# Altium schematic sheet 3.3V.SchDoc
size A3; SheetNumber: 3; SheetTotal: 3; SPICEModelCacheDQQPIFSE: <root> / <DocumentId>DQQPIFSE</DocumentId> / <CacheFrame Number="0"> / <Model Name="cout" Kind="CKT"> / <Text>*$ / .SUBCKT Cout 2 4 / R1 2 3 0.0031 / C1 3 4 7.231815776419501E-6 / R3 5 4 5 / R2 2 4 1.3827785868946785E8 / R4 3 26 688888.8888888889 / R6 3 7 688.8888888888889 / C5 7 1 2.1695447329258503E-7 / R7 3 10 68.88888888888889 / C6 10 1 2.1695447329258503E-7 / R8 3 13 6.888888888888889 / C7 13 1 2.1695447329258503E-7 / C2 26 1 2.1695447329258503E-7 / R9 3 28 68888.88888888889 / C3 28 1 2.1695447329258503E-7 / R10 3 29 6888.88888888889 / C4 29 1 2.1695447329258503E-7 / L8 1 5 15p / R24 1 5 0.0093 / L12 5 4 1n / .ENDS</Text> / </Model> / <Model Name="3010_74438333022_2.2u" Kind="CKT"> / <Text>******* / .subckt 3010_74438333022_2.2u 1 2 / Rp 1 2 5803.666667 / Cp 1 2 4.724p / Rs 1 N3 0.15 / L1 N3 2 2.1u / .ends 3010_74438333022_2.2u</Text> / </Model> / </CacheFrame> / </root>
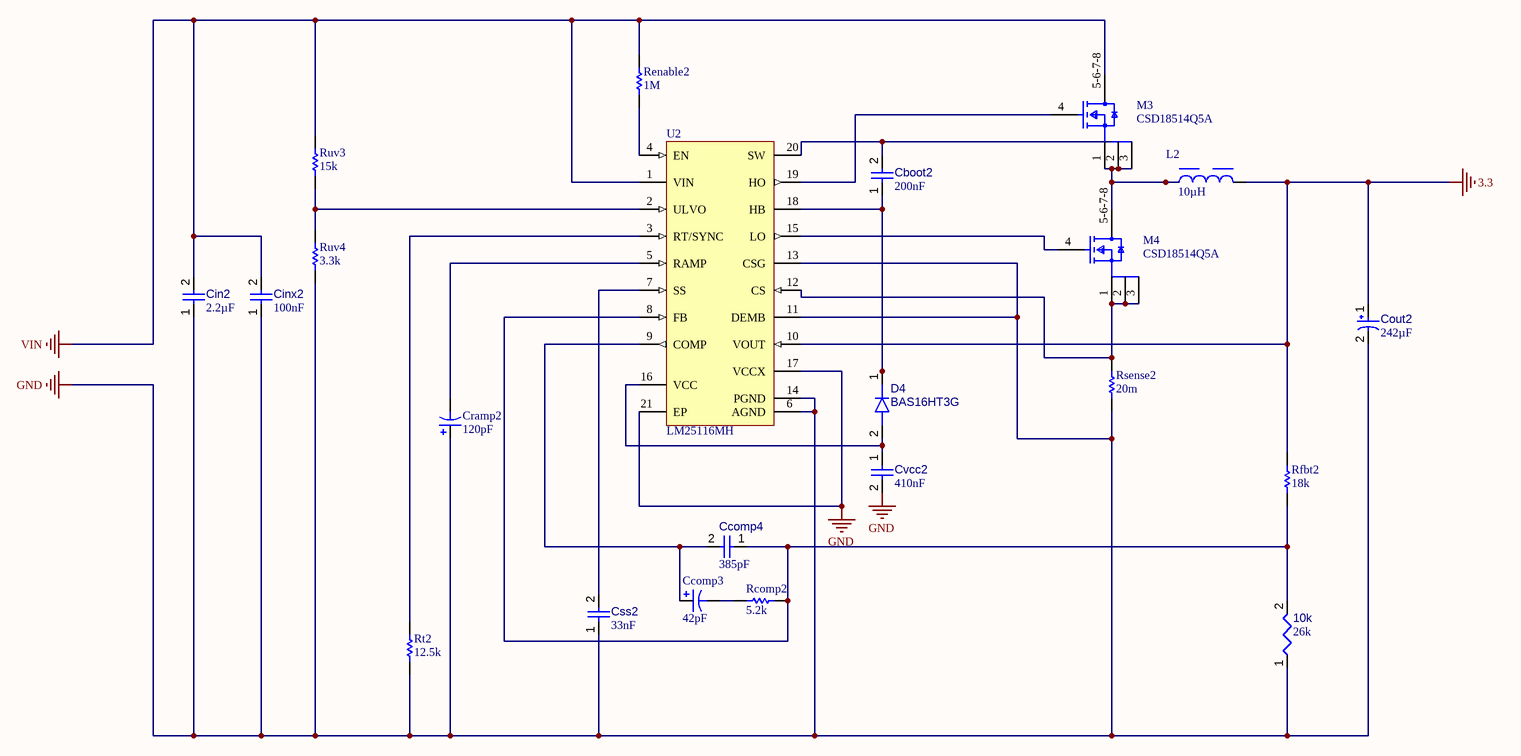
[diagram p0: 3.3V.SchDoc]

## Parts
10k  value 26k  [RESC2013X50X35ML15T15]  (hidden comment: Resistor 10k +/-1% 0805 125 mW)
Cboot2  value 200nF  [CAPC2013X95X50LL10T25]  (hidden comment: Capacitor 100 nF +/-10% 50 V 0805)
Ccomp3  value 42pF  [C0805]  (hidden comment: Cap Pol3)
Ccomp4  value 385pF  [CAPC2013X135X45NL10T25]  (hidden comment: Capacitor 10 uF +/- 10% 16 V 0805)
Cin2  value 2.2µF  [CAPC2013X135X45NL10T25]  (hidden comment: Capacitor 1 uF +/- 10% 50 V 0805)
Cinx2  value 100nF  [CAPC2013X95X50LL10T25]  (hidden comment: Capacitor 100 nF +/-10% 50 V 0805)
Cout2  value 242µF  [CAPPR65-500-1250X1000X1350]  (hidden comment: ECA-1HM221)
Cramp2  value 120pF  [C0805]  (hidden comment: Cap Pol3)
Css2  value 33nF  [CAPC2013X95X50LL10T25]  (hidden comment: Capacitor 100 nF +/-10% 50 V 0805)
Cvcc2  value 410nF  [CAPC2013X145X50ML20T25]  (hidden comment: Capacitor 1 uF +/- 10% 25 V 0805)
D4  BAS16HT3G
L2  Inductance: 10µH  [WE-MAPI_3010]  (hidden comment: 74438333022)
M3  CSD18514Q5A  [FP-DQJ0008A-MFG]
M4  CSD18514Q5A  [FP-DQJ0008A-MFG]
Rcomp2  value 5.2k  [RESC2013X50X35ML15T15]  (hidden comment: Resistor 0R +/- 1% 0805 125 mW)
Renable2  value 1M  [RESC2013X50X35ML15T15]  (hidden comment: Resistor 0R +/- 1% 0805 125 mW)
Rfbt2  value 18k  [RESC2013X50X35ML15T15]  (hidden comment: Resistor 0R +/- 1% 0805 125 mW)
Rsense2  value 20m  [RESC2013X50X35ML15T15]  (hidden comment: Resistor 0R +/- 1% 0805 125 mW)
Rt2  value 12.5k  [RESC2013X50X35ML15T15]  (hidden comment: Resistor 0R +/- 1% 0805 125 mW)
Ruv3  value 15k  [RESC2013X50X35ML15T15]  (hidden comment: Resistor 0R +/- 1% 0805 125 mW)
Ruv4  value 3.3k  [RESC2013X50X35ML15T15]  (hidden comment: Resistor 0R +/- 1% 0805 125 mW)
U2  LM25116MH  [PWP0020A_N]

## Nets
3.3: Cout2.1 L2.2 Rfbt2.2 U2.10(VOUT)
GND: 10k.1 Cin2.1 Cinx2.1 Cout2.2 Cramp2.1 Css2.1 Cvcc2.2 Rsense2.1 Rt2.1 Ruv4.1 U2.6(AGND) U2.11(DEMB) U2.13(CSG) U2.14(PGND) U2.17(VCCX) U2.21(EP)
VIN: Cin2.2 Cinx2.2 M3.5-6-7-8(D) Renable2.2 Ruv3.2 U2.1(VIN)
Net10k_2: 10k.2 Ccomp4.1 Rcomp2.1 Rfbt2.1 U2.8(FB)
NetCboot2_1: Cboot2.1 D4.1(K) U2.18(HB)
NetCboot2_2: Cboot2.2 U2.20(SW)
NetCcomp3_1: Ccomp3.1 Ccomp4.2 U2.9(COMP)
NetCcomp3_2: Ccomp3.2 Rcomp2.2
NetCramp2_2: Cramp2.2 U2.5(RAMP)
NetCss2_2: Css2.2 U2.7(SS)
NetCvcc2_1: Cvcc2.1 D4.2(A) U2.16(VCC)
NetL2_1: L2.1 M3.1(S) M3.2(S) M3.3(S) M4.5-6-7-8(D)
NetM3_4: M3.4(G) U2.19(HO)
NetM4_1: M4.1(S) M4.2(S) M4.3(S) Rsense2.2 U2.12(CS)
NetM4_4: M4.4(G) U2.15(LO)
NetRenable2_1: Renable2.1 U2.4(EN)
NetRt2_2: Rt2.2 U2.3(RT/SYNC)
NetRuv3_1: Ruv3.1 Ruv4.2 U2.2(ULVO)

## Library data of the parts
10k = CMP-009-00018-5: Chip Resistor, 10 KOhm, +/- 1%, 125 mW, -55 to 155 degC, 0805 (2012 Metric); Power: 125mW; Voltage Rating: 150V; Tolerance: 1%; Pins: 2; Min Operating Temperature: -55°C; Case/Package: 0805; Max Operating Temperature: 155°C; RoHS Compliant: True; Mounting Technology: SM
Cboot2 Cinx2 Css2 = CMP-001-00018-6: Chip Capacitor, 100 nF, +/- 10%, 50 V, 0805 (2012 Metric); Capacitor Type: Ceramic; Voltage Rating: 50V; Pins: 2; Max Operating Temperature: 125°C; Min Operating Temperature: -55°C; Mounting Technology: SM; Case/Package: 0805; RoHS Compliant: True; Tolerance: 10%
Ccomp3 Cramp2 = CMP-001-00095-1: Polarized Capacitor (Surface Mount); Signal Integrity: Cap Pol; Component Type: Standard; Case/Package: Chip Capacitor; Source: Miscellaneous Devices.SchLib; Publisher: Altium Limited; Published: 8-Jun-2000; PackageReference: C0805; LatestRevisionDate: 29-May-2009; Pins: 2; LatestRevisionNote: IPC-7351 Footprint Added.; Design Item ID: Cap Pol3
Ccomp4 = CMP-001-00015-6: Chip Capacitor, 10 uF, +/- 10%, 16 V, 0805 (2012 Metric); Voltage Rating: 16V; Capacitor Type: Ceramic; RoHS Compliant: True; Max Operating Temperature: 85°C; Min Operating Temperature: -55°C; Mounting Technology: SM; Tolerance: 10%; Case/Package: 0805; Pins: 2
Cin2 = CMP-001-00007-6: Chip Capacitor, 1 uF, +/- 10%, 50 V, 0805 (2012 Metric); Capacitor Type: Ceramic; Voltage Rating: 50V; Min Operating Temperature: -55°C; RoHS Compliant: True; Mounting Technology: SM; Case/Package: 0805; Max Operating Temperature: 125°C; Tolerance: 10%; Pins: 2
Cout2 = CMP-001-00028-7: Aluminum Electrolytic Capacitor, 220 uF, +/- 20%, 50 V, -40 to 85 degC, 2-Pin THD, RoHS, Bulk; Manufacturer: Panasonic; Ripple Current (AC): 400mA; Voltage Rating: 50V; Case/Package: Radial; Packaging: Bulk; Package Quantity: 200; Min Operating Temperature: -40°C; Datasheet Version: Mar-16; Package Reference: CAPPR65-500-1250X1000X1350; Mounting Technology: TH; Ripple Current: 400mA; Pins: 2; Package Description: 2-Pin Radial Lead, Dia 10 mm, Body Length 12.5 mm; RoHS Compliant: True; Max Operating Temperature: 85°C; Lead Pitch: 5mm; Tolerance: 20%; Manufacturer URL: http://www.panasonic.com/; Diameter: 10mm; Capacitor Type: Electrolytic; Datasheet URL: http://industrial.panasonic.com/cdbs/www-data/pdf/RDF0000/DMF0000COL68.pdf
Cvcc2 = CMP-001-00010-6: Chip Capacitor, 1 uF, +/-10%, 25 V, 0805 (2012 Metric); Capacitor Type: Ceramic; Voltage Rating: 25V; RoHS Compliant: True; Pins: 2; Mounting Technology: SM; Max Operating Temperature: 125°C; Min Operating Temperature: -55°C; Tolerance: 10%; Case/Package: 0805
D4 = CMP-004-00126-1: Rectifier Diode Small Signal Switching 0.2A 6ns Automotive 2-Pin SOD-323 T/R; Forward Voltage: 715mV; Max Operating Temperature: 150°C; Pins: 2; Min Operating Temperature: -55°C; Case/Package: SOD-323-2
L2 = CMP-006-00070-1: WE-MAPI SMT Power Inductor, size 3010, 2.2µH, 2.35A, 50MHz; Manufacturer: Wurth Elektronik; Saturation Current @ 30%: 4.85A; DC Resistance: 150mO; Operating Voltage (DC): 80V; Component Type: Standard; Design Item ID: 74438333022; Height: 1mm; Category: Power Inductors; Pins: 2; ComponentLink2URL: https://www.we-online.com/redexpert/spec/74438333022?ad; ComponentLink1URL: https://www.we-online.com/redexpert/article/74438333022?ad; Mount: Surface Mount; Max Operating Temperature: 125°C; ComponentLink2Description: Datasheet Link; Case/Package: 3010; Packaging: Tape and Reel; Min Operating Temperature: -40°C; ComponentLink1Description: Website Link; Source: WE-MAPI.SchLib; Performance Rated Current: 2.35A; Manufacturer Part Number: 74438333022; Self Resonant Frequency: 50MHz; Length: 3mm; Width: 3mm; Match Code: WE-MAPI
M3 M4 = CMP-011-00052-1: 40-V, N channel NexFET™ power MOSFET, single SON 5 mm x 6 mm, 4.9 mOhm 8-VSONP -55 to 150; Pins: 8; Max Operating Temperature: 150°C; Min Operating Temperature: -55°C
Rcomp2 Renable2 Rfbt2 Rsense2 Rt2 Ruv3 Ruv4 = CMP-009-00001-5: Chip Resistor, 0 Ohm, +/- 1%, 125 mW, -55 to 155 degC, 0805 (2012 Metric); Voltage Rating: 150V; Power: 125mW; Mounting Technology: SM; Max Operating Temperature: 155°C; Case/Package: 0805; RoHS Compliant: True; Pins: 2; Min Operating Temperature: -55°C; Tolerance: 1%
U2 = CMP-00024-00007-1: 6-42V Wide Vin, Current Mode Synchronous Buck Controller 20-HTSSOP -40 to 125; Min Operating Temperature: -40°C; Case/Package: HTSSOP EP; Mounting Technology: Surface Mount; Max Operating Temperature: 125°C; Pins: 20